# EasyEDA schematic SCH_nRF24L01-Messenger_2025-01-26.json
TITLE: nRF24 Messenger; REV: 1.0; Date: 2025-01-25; Sheet: 1/1; Drawn By: Anson; Company: Anson
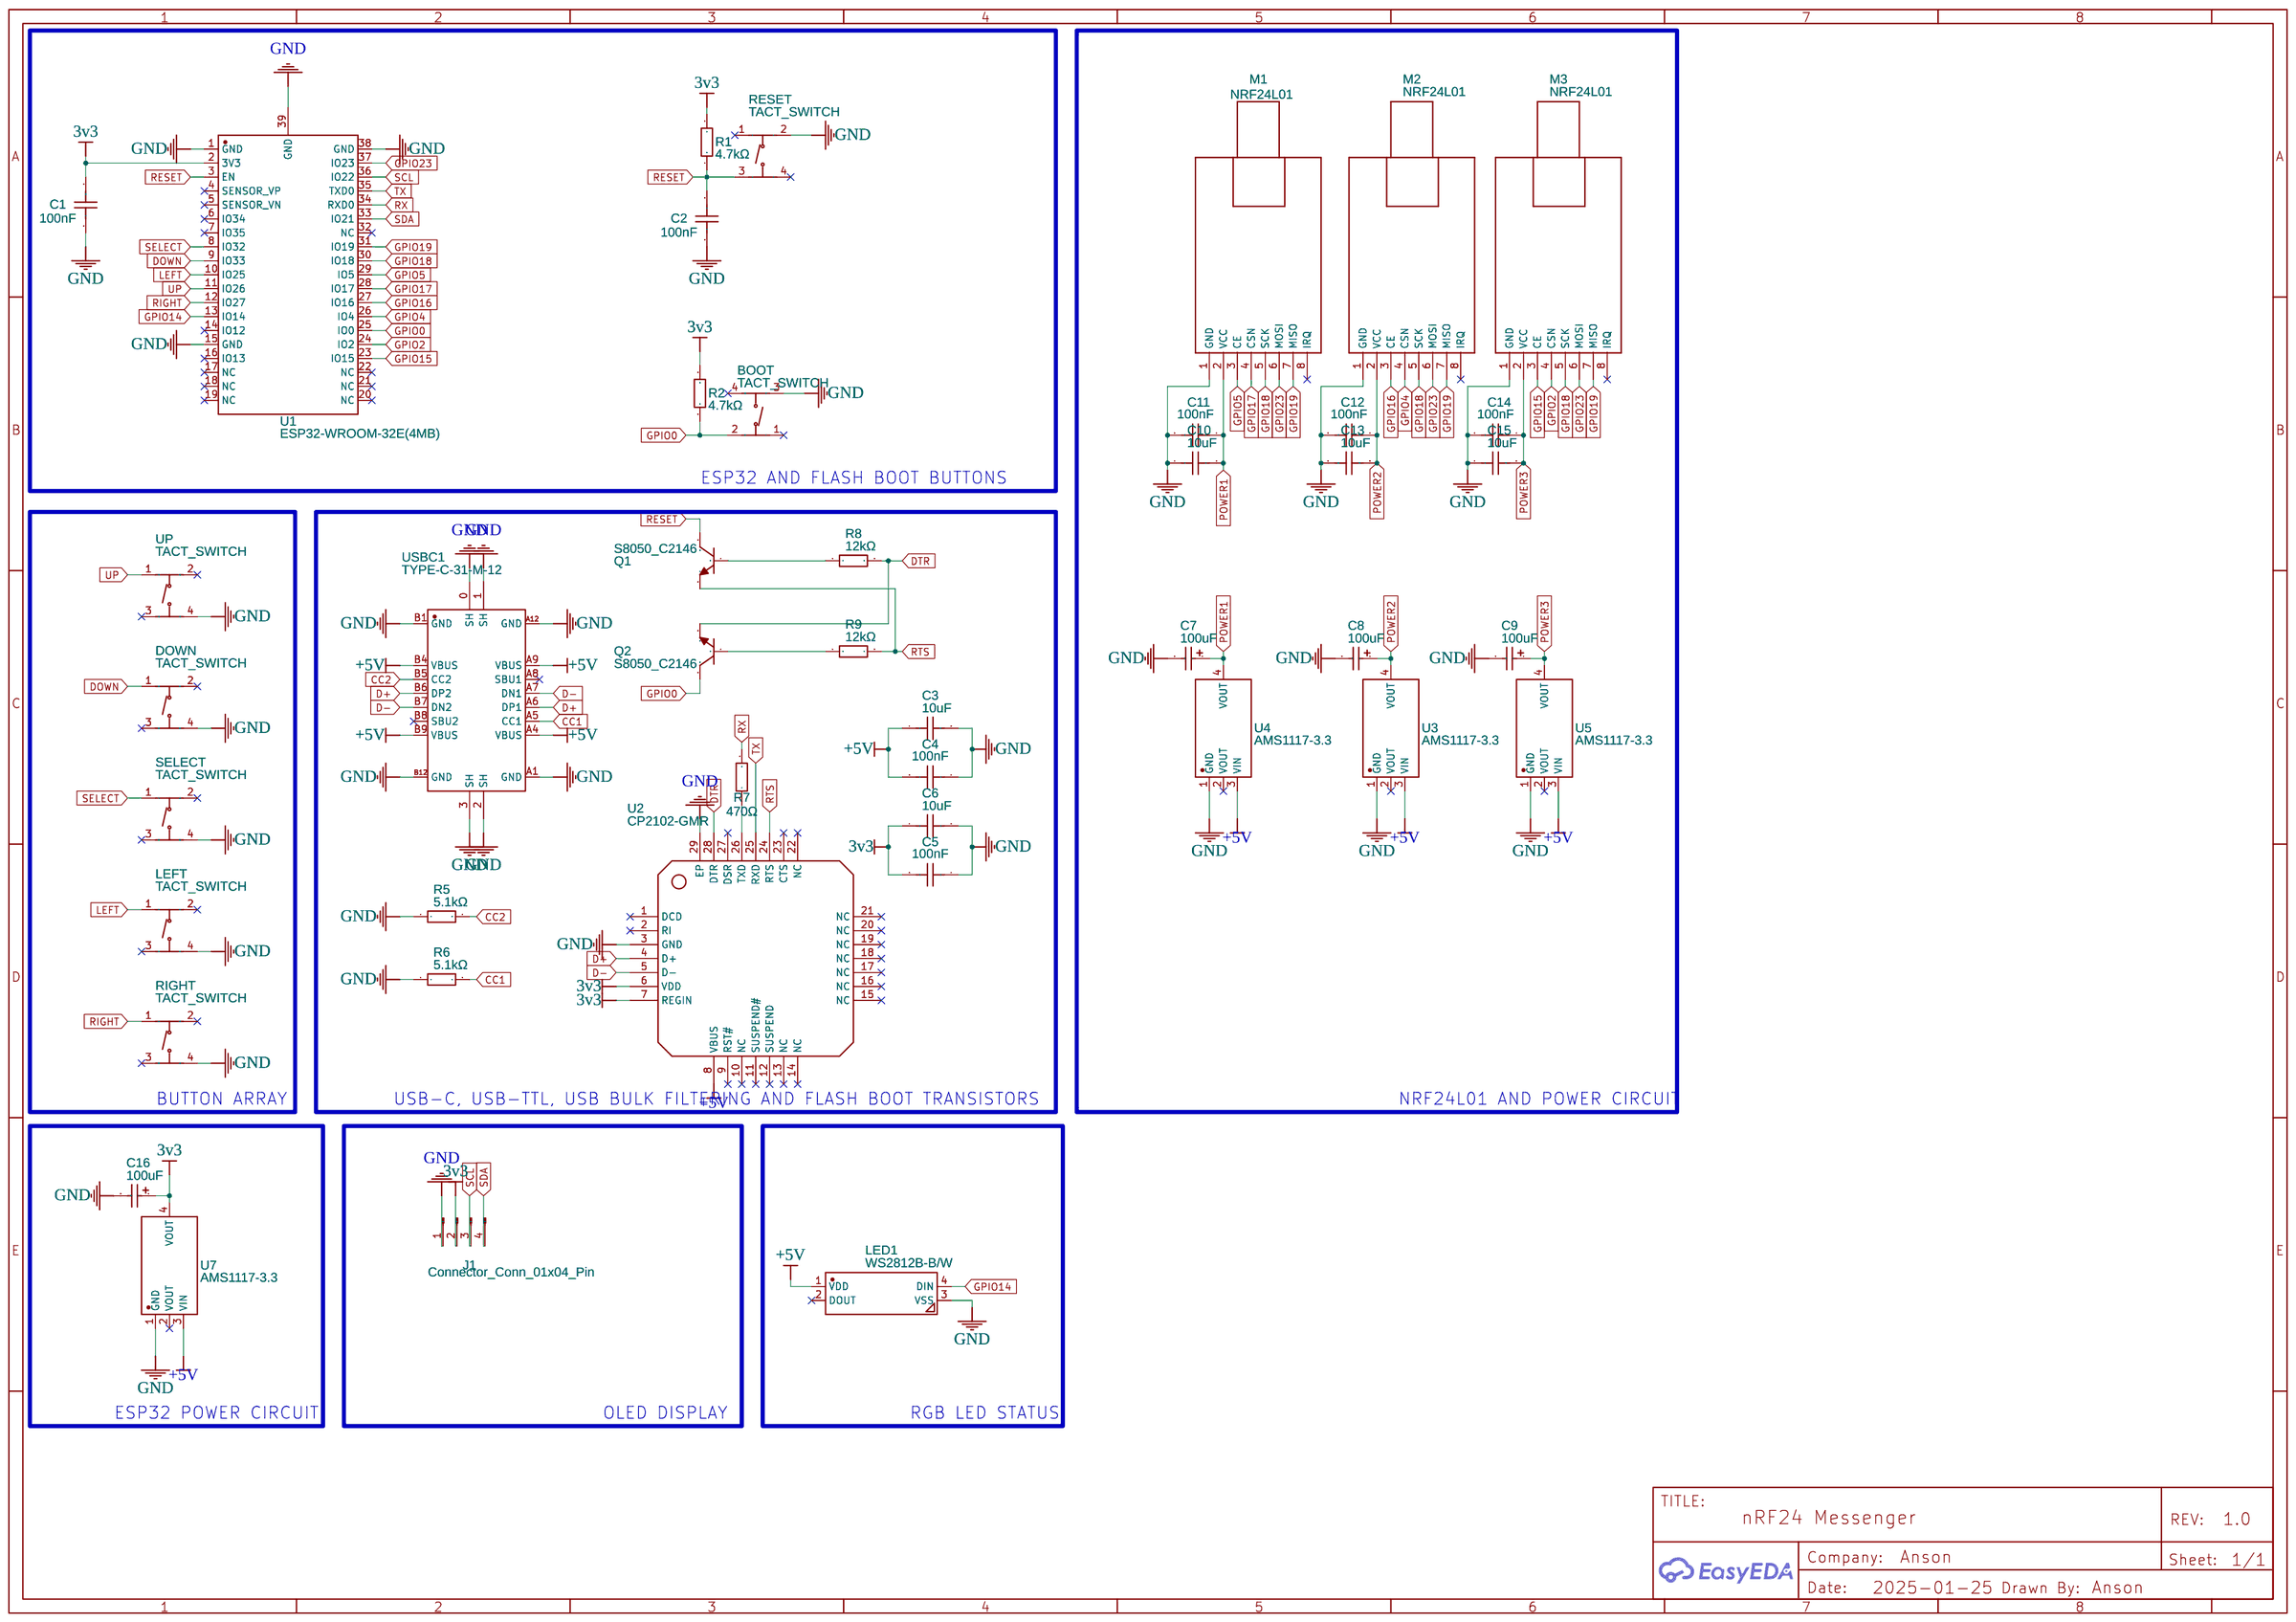
[diagram p0: schematic sheet]

## Parts
BOOT  TACT_SWITCH  [SW-SMD_4P-L5.1-W5.1-P3.70-LS6.5-TL_H1.5]
C1  100nF  [C0805]
C2  100nF  [C0805]
C3  10uF  [C0805]
C4  100nF  [C0805]
C5  100nF  [C0805]
C6  10uF  [C0805]
C7  100uF  [CASE-B_3528]
C8  100uF  [CASE-B_3528]
C9  100uF  [CASE-B_3528]
C10  10uF  [C0805]
C11  100nF  [C0805]
C12  100nF  [C0805]
C13  10uF  [C0805]
C14  100nF  [C0805]
C15  10uF  [C0805]
C16  100uF  [CASE-B_3528]
DOWN  TACT_SWITCH  [SW-SMD_4P-L5.1-W5.1-P3.70-LS6.5-TL_H1.5]
J1  Connector_Conn_01x04_Pin  [CONNECTOR_PINHEADER_2.54MM:PINHEADER_1X04_P2.54MM_VERTICAL]
LED1  WS2812B-B/W  [LED-SMD_4P-L5.0-W5.0-TL_WS2812B-B]
LEFT  TACT_SWITCH  [SW-SMD_4P-L5.1-W5.1-P3.70-LS6.5-TL_H1.5]
M1  NRF24L01  [WIRELESS-NRF24L01-PA-EXT]
M2  NRF24L01  [WIRELESS-NRF24L01-PA-EXT]
M3  NRF24L01  [WIRELESS-NRF24L01-PA-EXT]
Q1  S8050_C2146  [SOT-23-3_L3.0-W1.7-P0.95-LS2.9-BR]
Q2  S8050_C2146  [SOT-23-3_L3.0-W1.7-P0.95-LS2.9-BR]
R1  4.7kΩ  [R0805]
R2  4.7kΩ  [R0805]
R5  5.1kΩ  [R0805]
R6  5.1kΩ  [R0805]
R7  470Ω  [R0805]
R8  12kΩ  [R0805]
R9  12kΩ  [R0805]
RESET  TACT_SWITCH  [SW-SMD_4P-L5.1-W5.1-P3.70-LS6.5-TL_H1.5]
RIGHT  TACT_SWITCH  [SW-SMD_4P-L5.1-W5.1-P3.70-LS6.5-TL_H1.5]
SELECT  TACT_SWITCH  [SW-SMD_4P-L5.1-W5.1-P3.70-LS6.5-TL_H1.5]
U1  ESP32-WROOM-32E(4MB)  [WIFI-SMD_ESP32-WROOM-32E]
U2  CP2102-GMR  [WQFN-28_L5.0-W5.0-P0.50-BL-EP3.2]
U3  AMS1117-3.3  [SOT-223-3_L6.5-W3.4-P2.30-LS7.0-BR]
U4  AMS1117-3.3  [SOT-223-3_L6.5-W3.4-P2.30-LS7.0-BR]
U5  AMS1117-3.3  [SOT-223-3_L6.5-W3.4-P2.30-LS7.0-BR]
U7  AMS1117-3.3  [SOT-223-3_L6.5-W3.4-P2.30-LS7.0-BR]
UP  TACT_SWITCH  [SW-SMD_4P-L5.1-W5.1-P3.70-LS6.5-TL_H1.5]
USBC1  TYPE-C-31-M-12  [USB-C_SMD-TYPE-C-31-M-12]

## Library data of the parts
BOOT DOWN LEFT RESET RIGHT SELECT UP = TS-1187A-B-A-B: Contributor: LCSC; Supplier: LCSC; Supplier Part: C318884; Manufacturer: XKB Connectivity(中国星坤); JLCPCB Part Class: Basic Part
C1 C2 C4 C5 C11 C12 C14 = CC0805KRX7R9BB104: Supplier: LCSC; Manufacturer: YAGEO(国巨); Supplier Part: C49678; JLCPCB Part Class: Basic Part
C3 C6 C10 C13 C15 = CL21A106KAYNNNE: Supplier: LCSC; Manufacturer: SAMSUNG(三星); Supplier Part: C15850; JLCPCB Part Class: Basic Part
C7-C9 C16 = TAJB107K006RNJ: Supplier: LCSC; Manufacturer: Kyocera AVX; Supplier Part: C16133; JLCPCB Part Class: Basic Part
J1 = Connector_Conn_01x04_Pin: Generic connector, single row, 01x04, script generated; Add into BOM: yes; Convert to PCB: yes; Origin Footprint: PinHeader_1x04_P2.54mm_Vertical; Contributor: ujay
LED1 = WS2812B-B/W: Contributor: LCSC; Supplier: LCSC; Supplier Part: C2761795; Manufacturer: worldsemi; Manufacturer Part: WS2812B-B/T; JLCPCB Part Class: Extended Part
M1-M3 = WIRELESS-NRF24L01-PA-EXT: Contributor: Daniel s
Q1 Q2 = S8050_C2146: Supplier: LCSC; Manufacturer: CJ(江苏长电/长晶); Manufacturer Part: S8050 J3Y(RANGE:200-350); Supplier Part: C2146; JLCPCB Part Class: Basic Part
R1 R2 = 0805W8F4701T5E: Supplier: LCSC; Manufacturer: UNI-ROYAL(厚声); Supplier Part: C17673; JLCPCB Part Class: Basic Part
R5 R6 = 0805W8F5101T5E: Supplier: LCSC; Manufacturer: UNI-ROYAL(厚声); Supplier Part: C27834; JLCPCB Part Class: Basic Part
R7 = 0805W8F4700T5E: Supplier: LCSC; Manufacturer: UNI-ROYAL(厚声); Supplier Part: C17710; JLCPCB Part Class: Basic Part
R8 R9 = 0805W8F1202T5E: Supplier: LCSC; Manufacturer: UNI-ROYAL(厚声); Supplier Part: C17444; JLCPCB Part Class: Basic Part
U1 = ESP32-WROOM-32E(4MB): Contributor: LCSC; Supplier: LCSC; Supplier Part: C701341; Manufacturer: ESPRESSIF(乐鑫); Manufacturer Part: ESP32-WROOM-32E-N4; JLCPCB Part Class: Extended Part
U2 = CP2102-GMR: Supplier: LCSC; Manufacturer: SKYWORKS/SILICON LABS(芯科); Supplier Part: C6568; JLCPCB Part Class: Extended Part
U3-U5 U7 = AMS1117-3.3: sourceId: dwIGgezVh; Supplier: LCSC; Manufacturer: AMS; Supplier Part: C6186; JLCPCB Part Class: Basic Part
USBC1 = TYPE-C-31-M-12: Contributor: LCSC; Supplier: LCSC; Supplier Part: C165948; Manufacturer: 韩国韩荣; JLCPCB Part Class: Extended Part

## Nets
3v3: C1.2 C5.2 C6.1 C16.1 J1.2(Pin) R1.2 R2.2 U1.2(3V3) U2.6(VDD) U2.7(REGIN) U7.4(VOUT)
+5V: C3.1 C4.2 LED1.1(VDD) U2.8(VBUS) U3.3(VIN) U4.3(VIN) U5.3(VIN) U7.3(VIN) USBC1.A4(VBUS) USBC1.A9(VBUS) USBC1.B4(VBUS) USBC1.B9(VBUS)
GND: BOOT.3(C) C1.1 C2.1 C3.2 C4.1 C5.1 C6.2 C7.2 C8.2 C9.2 C10.1 C11.2 C12.2 C13.1 C14.2 C15.1 C16.2 DOWN.4(D) J1.1(Pin) LED1.3(VSS) LEFT.4(D) M1.1(GND) M2.1(GND) M3.1(GND) R5.1 R6.1 RESET.2(B) RIGHT.4(D) SELECT.4(D) U1.1(GND) U1.15(GND) U1.38(GND) U1.39(GND) U2.3(GND) U2.29(EP) U3.1(GND) U4.1(GND) U5.1(GND) U7.1(GND) UP.4(D) USBC1.0(SH) USBC1.1(SH) USBC1.2(SH) USBC1.3(SH) USBC1.A1(GND) USBC1.A12(GND) USBC1.B1(GND) USBC1.B12(GND)
CC1: R6.2 USBC1.A5(CC1)
CC2: R5.2 USBC1.B5(CC2)
D+: U2.4(D+) USBC1.A6(DP1) USBC1.B6(DP2)
D-: U2.5(D-) USBC1.A7(DN1) USBC1.B7(DN2)
DOWN: DOWN.1(A) U1.9(IO33)
DTR: Q2.2(E) R8.2 U2.28(DTR)
GPIO0: BOOT.2(B) Q2.3(C) R2.1 U1.25(IO0)
GPIO2: M3.4(CSN) U1.24(IO2)
GPIO4: M2.4(CSN) U1.26(IO4)
GPIO5: M1.3(CE) U1.29(IO5)
GPIO14: LED1.4(DIN) U1.13(IO14)
GPIO15: M3.3(CE) U1.23(IO15)
GPIO16: M2.3(CE) U1.27(IO16)
GPIO17: M1.4(CSN) U1.28(IO17)
GPIO18: M1.5(SCK) M2.5(SCK) M3.5(SCK) U1.30(IO18)
GPIO19: M1.7(MISO) M2.7(MISO) M3.7(MISO) U1.31(IO19)
GPIO23: M1.6(MOSI) M2.6(MOSI) M3.6(MOSI) U1.37(IO23)
LEFT: LEFT.1(A) U1.10(IO25)
POWER1: C7.1 C10.2 C11.1 M1.2(VCC) U4.4(VOUT)
POWER2: C8.1 C12.1 C13.2 M2.2(VCC) U3.4(VOUT)
POWER3: C9.1 C14.1 C15.2 M3.2(VCC) U5.4(VOUT)
RESET: C2.2 Q1.3(C) R1.1 RESET.3(C) U1.3(EN)
RIGHT: RIGHT.1(A) U1.12(IO27)
RTS: Q1.2(E) R9.2 U2.24(RTS)
RX: R7.2 U1.34(RXD0)
SCL: J1.3(Pin) U1.36(IO22)
SDA: J1.4(Pin) U1.33(IO21)
SELECT: SELECT.1(A) U1.8(IO32)
TX: U1.35(TXD0) U2.25(RXD)
UP: U1.11(IO26) UP.1(A)
Net-(Q1-1): Q1.1(B) R8.1
Net-(Q2-1): Q2.1(B) R9.1
Net-(R7-1): R7.1 U2.26(TXD)

Not connected (* = marked no-connect by the designer): BOOT 1(A)* 4(D)*; DOWN 2(B)* 3(C)*; LED1 2(DOUT)*; LEFT 2(B)* 3(C)*; M1 8(IRQ)*; M2 8(IRQ)*; M3 8(IRQ)*; RESET 1(A)* 4(D)*; RIGHT 2(B)* 3(C)*; SELECT 2(B)* 3(C)*; U1 4(SENSOR_VP)* 5(SENSOR_VN)* 6(IO34)* 7(IO35)* 14(IO12)* 16(IO13)* 17(NC)* 18(NC)* 19(NC)* 20(NC)* 21(NC)* 22(NC)* 32(NC)*; U2 1(DCD)* 2(RI)* 9(RST#)* 10(NC)* 11(SUSPEND#)* 12(SUSPEND)* 13(NC)* 14(NC)* 15(NC)* 16(NC)* 17(NC)* 18(NC)* 19(NC)* 20(NC)* 21(NC)* 22(NC)* 23(CTS)* 27(DSR)*; U3 2(VOUT)*; U4 2(VOUT)*; U5 2(VOUT)*; U7 2(VOUT)*; UP 2(B)* 3(C)*; USBC1 A8(SBU1)* B8(SBU2)*

## Notes on the sheet
- ESP32 AND FLASH BOOT BUTTONS
- BUTTON ARRAY
- USB-C, USB-TTL, USB BULK FILTERING AND FLASH BOOT TRANSISTORS
- NRF24L01 AND POWER CIRCUIT
- ESP32 POWER CIRCUIT
- OLED DISPLAY
- RGB LED STATUS
